# Altium schematic sheet [05] - L70.SchDoc: =ProjectName
size A4; CheckedBy: Ven; Author: Ven; CompanyName: HUST; Revision: V.1.0
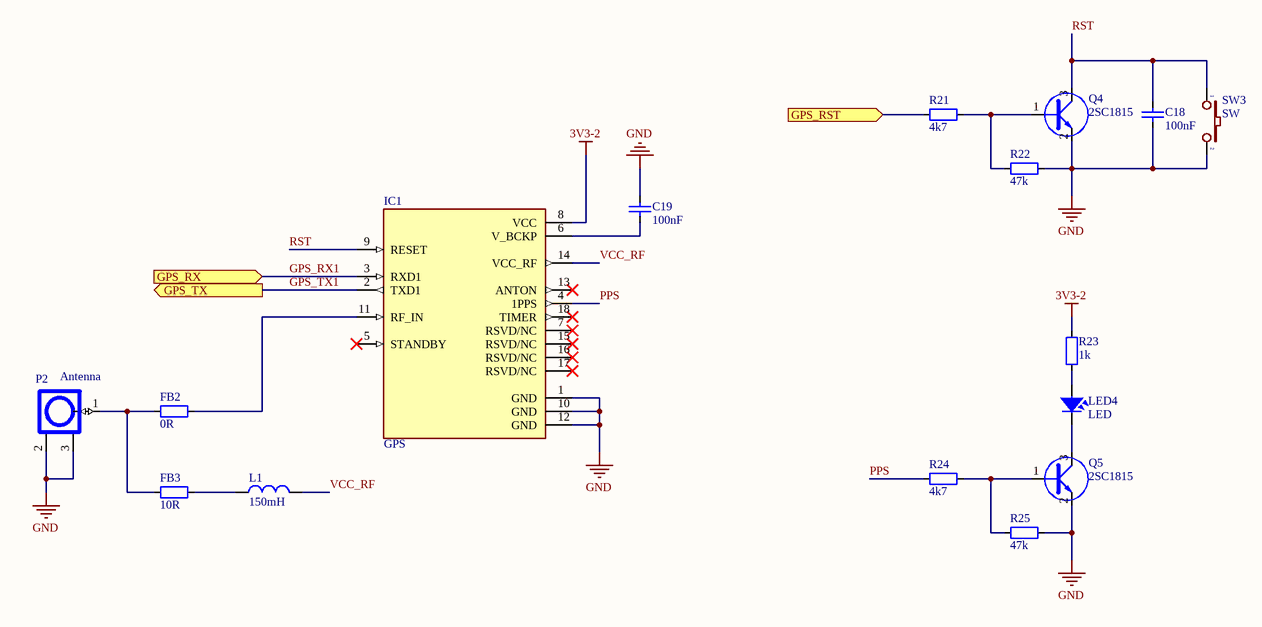
[diagram p0: [05] - L70.SchDoc]

## Parts
C18  100nF  [CAP_0603]
C19  100nF  [CAP_0603]
FB2  0R  [RES-SMD-0603]
FB3  10R  [RES-SMD-0603]
IC1  GPS  [L70]
L1  150mH  [L-0603]
LED4  LED  [LED-0805-Green]
P2  Antenna  [IPXS]
Q4  2SC1815  [SOT23]
Q5  2SC1815  [SOT23]
R21  4k7  [RES-SMD-0603]
R22  47k  [RES-SMD-0603]
R23  1k  [RES-SMD-0603]
R24  4k7  [RES-SMD-0603]
R25  47k  [RES-SMD-0603]
SW3  SW  [SW2]

## Ports
GPS_RST (in), GPS_RX (in), GPS_TX (out)

## Nets
3V3-2: IC1.8(VCC) R23.2
GND: C18.1 C19.1 IC1.1(GND) IC1.10(GND) IC1.12(GND) P2.2 P2.3 Q4.2(E) Q5.2(E) R22.2 R25.2 SW3.2
GPS_RST: R21.1 ; port GPS_RST
GPS_RX1: IC1.3(RXD1) ; port GPS_RX
GPS_TX1: IC1.2(TXD1) ; port GPS_TX
PPS: IC1.4(1PPS) R24.1
RST: C18.2 IC1.9(RESET) Q4.3(C) SW3.1
VCC_RF: IC1.14(VCC_RF) L1.2
NetC19_2: C19.2 IC1.6(V_BCKP)
NetFB2_1: FB2.1 FB3.1 P2.1
NetFB2_2: FB2.2 IC1.11(RF_IN)
NetFB3_2: FB3.2 L1.1
NetLED4_1: LED4.1 R23.1
NetLED4_2: LED4.2 Q5.3(C)
NetQ4_1: Q4.1(B) R21.2 R22.1
NetQ5_1: Q5.1(B) R24.2 R25.1

Not connected (* = marked no-connect by the designer): IC1 5(STANDBY)* 7(RSVD/NC)* 13(ANTON)* 15(RSVD/NC)* 16(RSVD/NC)* 17(RSVD/NC)* 18(TIMER)*

## Notes on the sheet
- Project:
- Page Contents:
- Size:
- Date:
- A4
- Checked by:
- Time:
- Revision:
- Sheet
- of
- File:

## Library data of the parts
C18 C19 = CapSMD: Capacitor; Value: 33p; Published: 8-Jun-2000; LatestRevisionDate: 17-Jul-2002; LatestRevisionNote: Re-released for DXP Platform.; PackageReference: RAD-0.3; Publisher: Altium Limited
FB2 FB3 R21-R25 = Resistor - SMD: Resistor; Manufacturer: Generic Components; Class: Passive; Published: 08/06/2000; Publisher: Altium Hobart Technology Centre
IC1 = L70: Quectel GPS IC
L1 = L1: Inductor; Value: 150 mH
LED4 = LED: LED Single colour Green and Red; Value: LED 3 ly Single Colour
P2 = IPXSx66: Antenna GSM GPS
Q4 Q5 = 2SC1815: NPN 600mW, ECB; Value: C1815
SW3 = SW2: Switch button 2 pin; Value: SW chip 2 pin